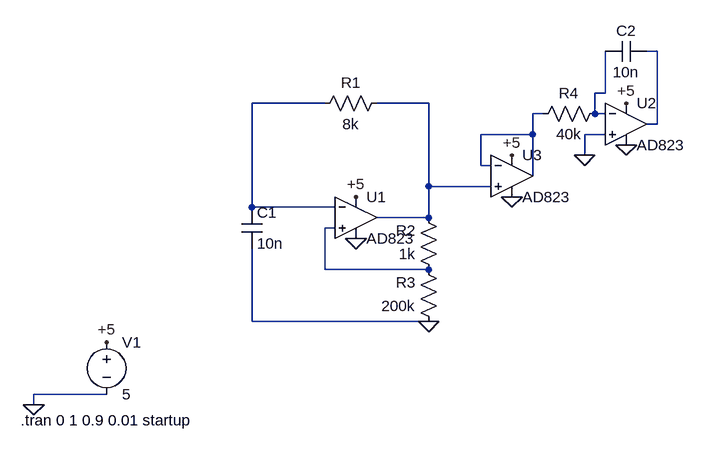
[diagram p0: schematic Triangle1.asc]
Triangle1.asc, the LTspice schematic file:
Version 4
SHEET 1 880 680
WIRE 672 -144 656 -144
WIRE 592 -80 592 -144
WIRE 592 -80 576 -80
WIRE 160 -64 48 -64
WIRE 320 -64 240 -64
WIRE 496 -48 480 -48
WIRE 576 -48 576 -80
WIRE 592 -48 576 -48
WIRE 672 -32 672 -144
WIRE 672 -32 656 -32
WIRE 480 -16 480 -48
WIRE 480 -16 400 -16
WIRE 592 -16 560 -16
WIRE 560 16 560 -16
WIRE 400 32 400 -16
WIRE 416 32 400 32
WIRE 480 48 480 -16
WIRE 320 64 320 -64
WIRE 416 64 320 64
WIRE 48 96 48 -64
WIRE 176 96 48 96
WIRE 320 112 320 64
WIRE 320 112 240 112
WIRE 176 128 160 128
WIRE 160 192 160 128
WIRE 320 192 160 192
WIRE 48 272 48 160
WIRE 320 272 48 272
WIRE -176 384 -288 384
WIRE -288 400 -288 384
FLAG -288 400 0
FLAG -176 304 +5
FLAG 208 80 +5
FLAG 624 -64 +5
FLAG 624 0 0
FLAG 208 144 0
FLAG 320 272 0
FLAG 560 16 0
FLAG 448 16 +5
FLAG 448 80 0
SYMBOL voltage -176 288 R0
WINDOW 123 0 0 Left 0
WINDOW 39 0 0 Left 0
SYMATTR InstName V1
SYMATTR Value 5
SYMBOL Opamps\\AD823 208 48 R0
SYMATTR InstName U1
SYMBOL Opamps\\AD823 624 -96 R0
SYMATTR InstName U2
SYMBOL cap 32 96 R0
SYMATTR InstName C1
SYMATTR Value 10n
SYMBOL res 256 -80 R90
WINDOW 0 0 56 VBottom 2
WINDOW 3 32 56 VTop 2
SYMATTR InstName R1
SYMATTR Value 8k
SYMBOL res 336 208 R180
WINDOW 0 36 76 Left 2
WINDOW 3 36 40 Left 2
SYMATTR InstName R2
SYMATTR Value 1k
SYMBOL res 336 288 R180
WINDOW 0 36 76 Left 2
WINDOW 3 36 40 Left 2
SYMATTR InstName R3
SYMATTR Value 200k
SYMBOL res 592 -64 R90
WINDOW 0 0 56 VBottom 2
WINDOW 3 32 56 VTop 2
SYMATTR InstName R4
SYMATTR Value 40k
SYMBOL cap 656 -160 R90
WINDOW 0 0 32 VBottom 2
WINDOW 3 32 32 VTop 2
SYMATTR InstName C2
SYMATTR Value 10n
SYMBOL Opamps\\AD823 448 -16 R0
SYMATTR InstName U3
TEXT -308 424 Left 2 !.tran 0 1 0.9 0.01 startup

The netlist it stands for:
* Triangle1.asc
V1 +5 0 5
XU1 N006 N003 +5 0 N004 AD823  ; pins In+ In- V+ V- OUT
XU2 0 N002 +5 0 N001 AD823  ; pins In+ In- V+ V- OUT
C1 N003 0 10n
R1 N004 N003 8k
R2 N006 N004 1k
R3 0 N006 200k
R4 N002 N005 40k
C2 N001 N002 10n
XU3 N004 N005 +5 0 N005 AD823  ; pins In+ In- V+ V- OUT
.tran 0 1 0.9 0.01 startup
.lib ADI.lib
.backanno
.end